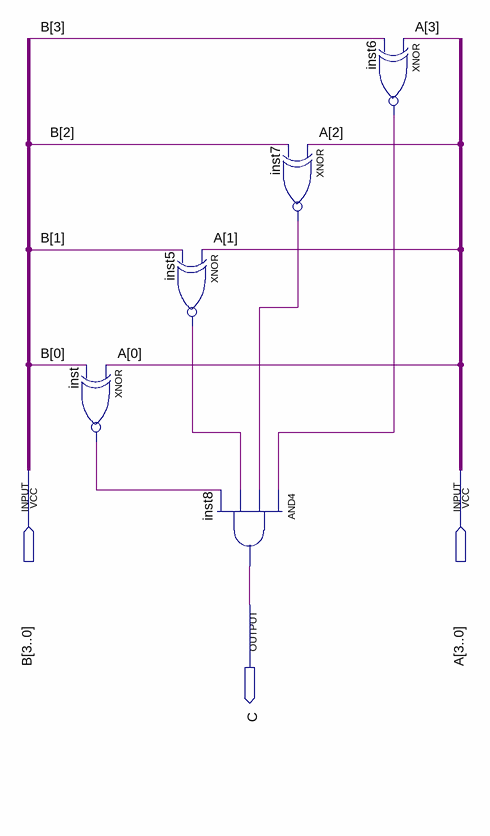
[diagram p0: schematic sheet]
// Quartus schematic Comp_igualdadeFull.bdf as structural Verilog: 5 symbols, 3 pins
module Comp_igualdadeFull (
  input  [3:0] B,
  input  [3:0] A,
  output C
);

  wire inst5_out, inst6_out, inst7_out, inst_out;

  xnor inst (inst_out, A[0], B[0]);
  xnor inst5 (inst5_out, A[1], B[1]);
  xnor inst7 (inst7_out, A[2], B[2]);
  and inst8 (C, inst6_out, inst7_out, inst5_out, inst_out);
  xnor inst6 (inst6_out, A[3], B[3]);
endmodule
